# EAGLE design adapter (EAGLE 7.5.0)
COPYRIGHT: (c) 2016 by Markus Reschke; PROJECT_INFO: for the Component Tester; PROJECT_NAME: Opto Coupler Test Adapter
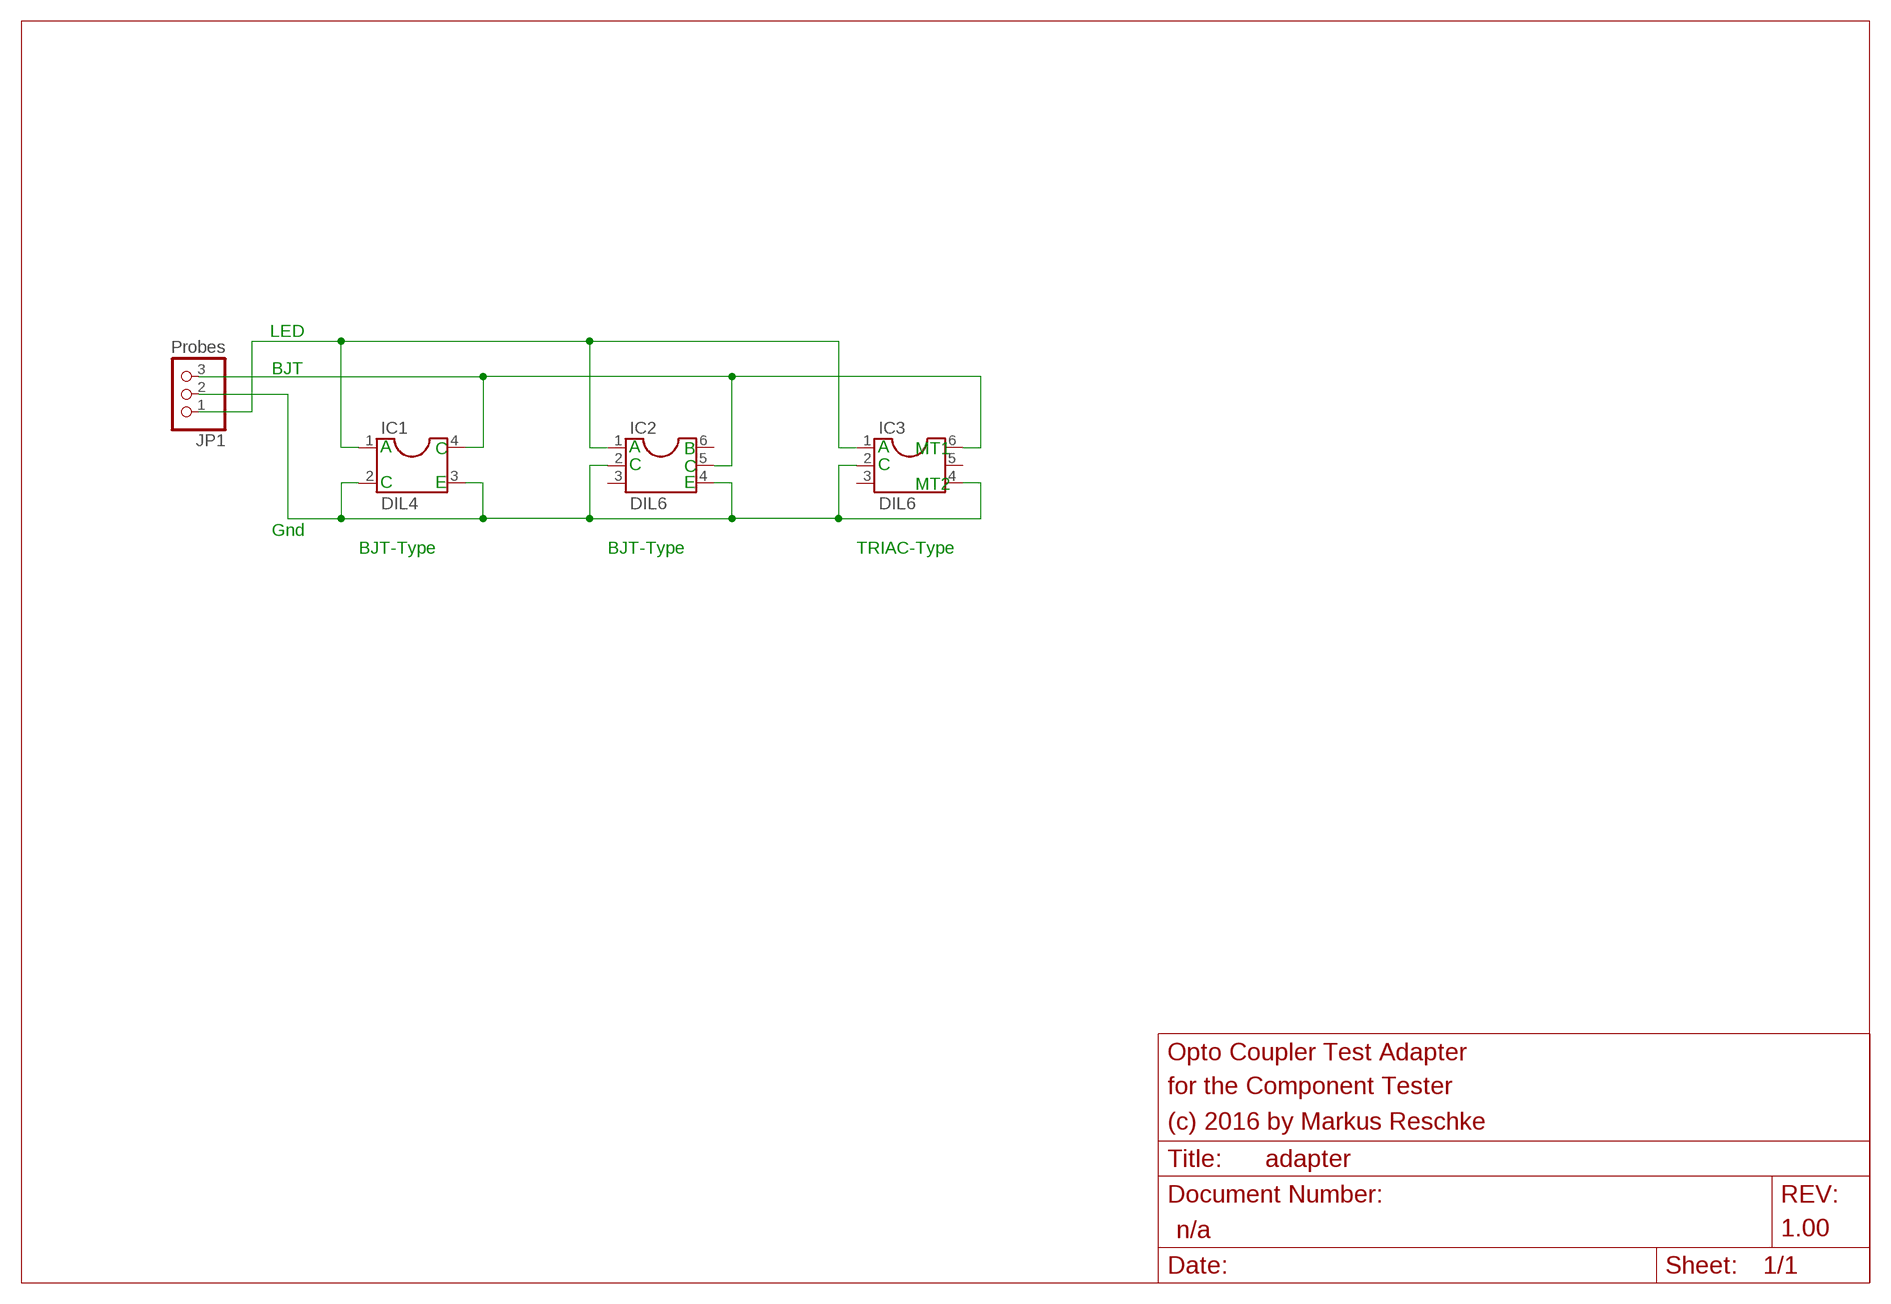
[diagram p0: schematic, sheet 1]
FRAME1 (FRAME_A4): DOCUMENT_ID: n/a; REVISION_ID: 1.00

## Parts
IC1  DIL4  DIL4S  [SOCKET-04]
IC2  DIL6  DIL6S  [SOCKET-06]
IC3  DIL6  DIL6S  [SOCKET-06]
JP1  Probes  PINHD-1X3/90  [1X03/90]

## Nets
COLLECTOR: IC1.4 IC2.5 IC3.6 JP1.3
GND: IC1.2 IC1.3 IC2.2 IC2.4 IC3.2 IC3.4 JP1.2
LED: IC1.1 IC2.1 IC3.1 JP1.1
Unconnected: IC2.3 IC2.6 IC3.3 IC3.5

## Notes on the sheet
- LED
- BJT
- A | C | A | B | A | MT1
- C | C | C
- C | E | E | MT2
- Gnd
- BJT-Type | BJT-Type | TRIAC-Type

## Library data of the parts
IC1 = ic-package:DIL4: Dual In Line / Socket
IC2 IC3 = ic-package:DIL6: Dual In Line / Socket
JP1 = pinhead:PINHD-1X3: PIN HEADER

## Board
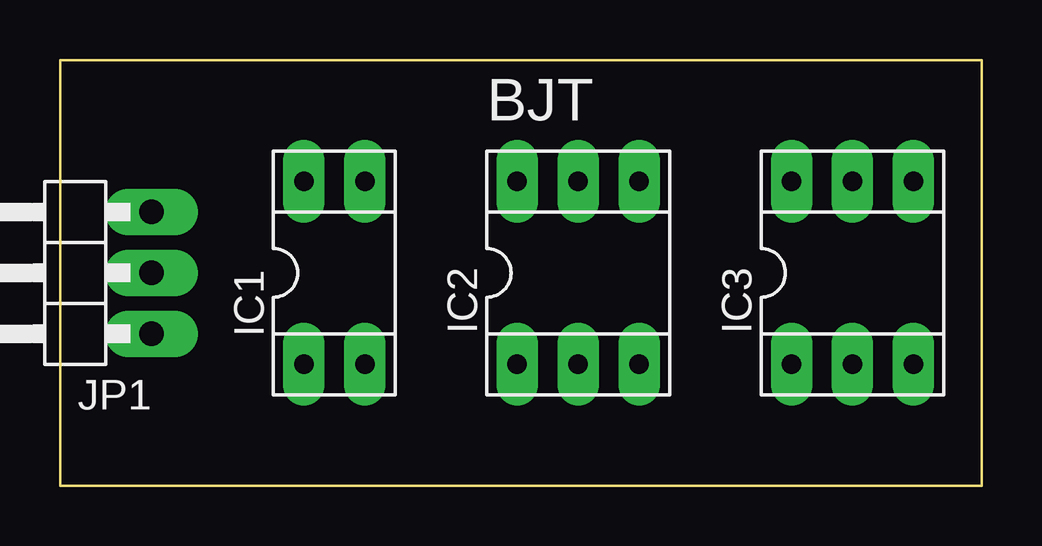
[diagram p1: board, top side]
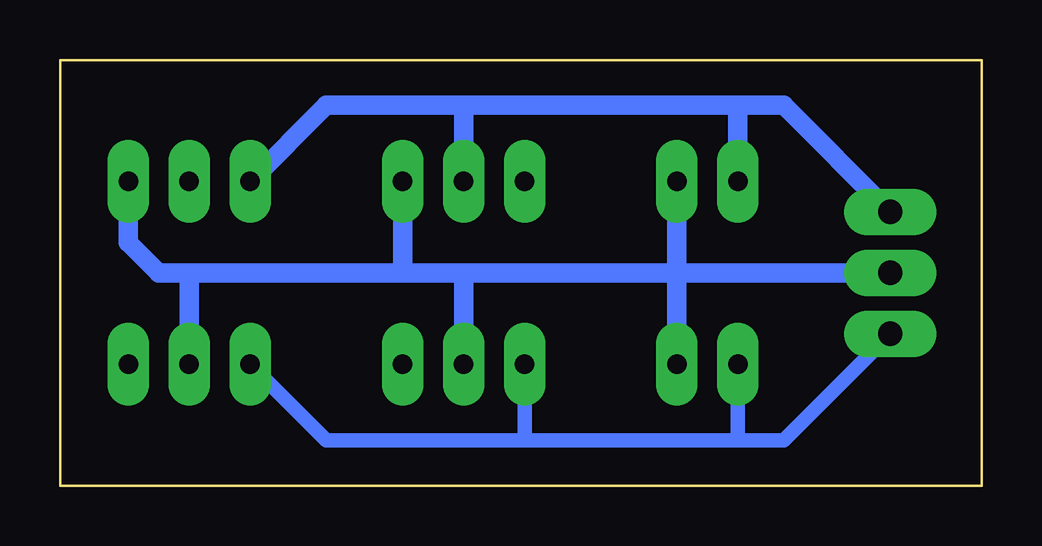
[diagram p2: board, bottom side, seen from below]

Size 38.41 x 17.77 mm. Coordinates in mm from the lower left corner, seen from the top.
Outline: 0,0 38.41,0 38.41,17.77 0,17.77 0,0
Copper layers (1*16): Top 0.035mm / dielectric 1.5mm / Bottom 0.035mm
Design rules "default *": minimum track width 10mil, minimum drill 24mil, track to track 8mil, track to pad 8mil, pad to pad 8mil, via to via 8mil, smd to smd 8mil, copper to edge 40mil, drill to drill 8mil, minimum pad ring 18mil, minimum via ring 8mil, stop-mask expansion 4mil, vias tented up to drill 0mil, thermal gap 10mil

### Footprints (pad centres in the part's own frame; a part is rotated, then mirrored left to right if it is on the bottom)
SOCKET-04 = drill 0.813 long: 1 -1.27,-3.81; 2 1.27,-3.81; 3 1.27,3.81; 4 -1.27,3.81
SOCKET-06 = drill 0.813 long: 1 -2.54,-3.81; 2 0,-3.81; 3 2.54,-3.81; 4 2.54,3.81; 5 0,3.81; 6 -2.54,3.81
1X03/90 = drill 1.016 long: 1 -2.54,-3.81; 2 0,-3.81; 3 2.54,-3.81

### Placement (x,y rotation side)
IC1  11.43,8.89 0 top
IC2  21.59,8.89 0 top
IC3  33.02,8.89 0 top
JP1  0,8.89 90 top

### Tracks (layer width: path | path; a pad name or v marks a point on that pad's centre or on a via)
COLLECTOR
  Bottom 0.813: IC1.4 10.16,15.88 | 10.16,15.88 21.59,15.88 | 21.59,15.88 IC2.5 | 21.59,15.88 27.3,15.88 IC3.6 | JP1.3 8.26,15.88 10.16,15.88
GND
  Bottom 0.813: IC1.3 12.7,8.89 | 12.7,8.89 IC1.2 | IC2.2 21.59,8.89 | IC2.4 24.13,8.89 | IC3.4 35.56,10.16 34.29,8.89 33.02,8.89 | IC3.2 33.02,8.89 | 33.02,8.89 24.13,8.89 | 24.13,8.89 21.59,8.89 | 21.59,8.89 12.7,8.89 | JP1.2 12.7,8.89
LED
  Bottom 0.61: IC1.1 10.16,1.91 | 10.16,1.91 19.05,1.91 | 19.05,1.91 IC2.1 | 19.05,1.91 27.3,1.91 IC3.1 | JP1.1 8.26,1.91 10.16,1.91

### Text on the board
tNames: BJT
tValues: BJT | Triac